# EAGLE design MAX5419 (EAGLE 8.2.2)
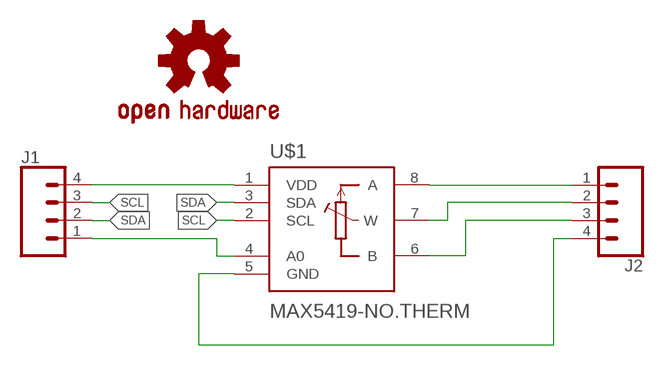
[diagram p0: schematic, sheet 1]

## Parts
J1  CONN_041X04_NO_SILK  [1X04_NO_SILK]
J2  CONN_041X04_NO_SILK  [1X04_NO_SILK]
LOGO1  OSHW-LOGOS  [OSHW-LOGO-S]
U$1  MAX5419-NO.THERM  [TDFN8-3X3MM]

## Nets
N$1: J2.1 U$1.8(A)
N$2: J2.2 U$1.7(W)
N$3: J2.3 U$1.6(B)
N$4: J2.4 U$1.5(GND)
N$5: J1.4 U$1.1(VDD)
N$8: J1.1 U$1.4(A0)
SCL: J1.3 U$1.2(SCL)
SDA: J1.2 U$1.3(SDA)

## Library data of the parts
J1 J2 = CalvEngIO-Connectors:CONN_04: Multi connection point. Often used as Generic Header-pin footprint for 0.1 inch spaced/style header connections On any of the 0.1 inch spaced packages, you can populate with these: Break Away Headers - Straight <https://www.sparkfun.com/products/116> (PRT-00116) Break Away Male Headers - Right Angle <https://www.sparkfun.com/products/553> (PRT-00553) Female Headers <https://www.sparkfun.com/products/115> (PRT-00115) Break Away Headers - Machine Pin <https://www.sparkfun.com/products/117> (PRT-00117) Break Away Female Headers - Swiss Machine Pin <https://www.sparkfun.com/products/743> (PRT-00743) For SCREWTERMINALS and SPRING TERMINALS visit here: Screw Terimnals on SparkFun.com <https://www.sparkfun.com/search/results?term=Screw+Terminals> (5mm/3.5mm/2.54mm spacing) This device is also useful as a general connection point to wire up your design to another part of your project. Our various solder wires solder well into these plated through hole pads. Hook-Up Wire - Assortment (Stranded, 22 AWG) <https://www.sparkfun.com/products/11375> (PRT-11375) Hook-Up Wire - Assortment (Solid Core, 22 AWG) <https://www.sparkfun.com/products/11367> (PRT-11367) View the entire wire category on our website here <https://www.sparkfun.com/categories/141> Special notes: Molex polarized connector foot print use with SKU : PRT-08231 with associated crimp pins and housings. 1MM SMD Version SKU: PRT-10208; PROD_ID: CONN-09696
LOGO1 = CalvEngIO-Logos:OSHW-LOGO: Open-Source Hardware (OSHW) Logo This logo indicates the piece of hardware it is found on incorporates a OSHW license and/or adheres to the definition of open source hardware found here: http://freedomdefined.org/OSHW
U$1 = CalvEngIO-DigitalIC:MAX5419

## Board
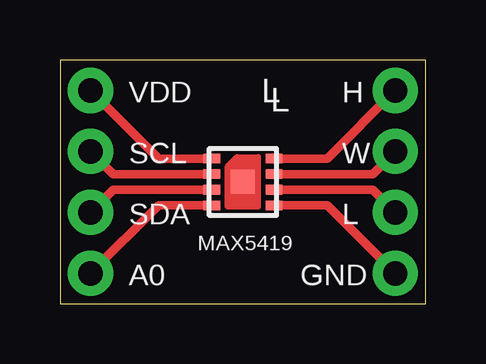
[diagram p1: board, top side]
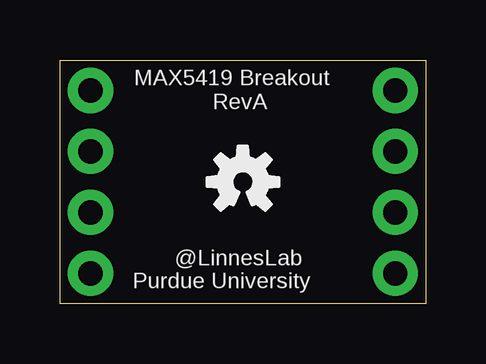
[diagram p2: board, bottom side, seen from below]

Size 15.24 x 10.16 mm. Coordinates in mm from the lower left corner, seen from the top.
Outline: 0,0 15.24,0 15.24,10.16 0,10.16 0,0
Copper layers (1*16): Top 0.035mm / dielectric 1.5mm / Bottom 0.035mm
Design rules "default": minimum track width 10mil, minimum drill 24mil, track to track 8mil, track to pad 8mil, pad to pad 8mil, via to via 8mil, smd to smd 8mil, copper to edge 40mil, drill to drill 8mil, minimum pad ring 10mil, minimum via ring 8mil, stop-mask expansion 4mil, vias tented up to drill 0mil, thermal gap 10mil

### Footprints (pad centres in the part's own frame; a part is rotated, then mirrored left to right if it is on the bottom)
1X04_NO_SILK = drill 1.016 pad 1.88: 1 0,0; 2 2.54,0; 3 5.08,0; 4 7.62,0
TDFN8-3X3MM = smd 0.7 x 0.4: 1 -1.3,0.975; 2 -1.3,0.325; 3 -1.3,-0.325; 4 -1.3,-0.975; 5 1.3,-0.975; 6 1.3,-0.325; 7 1.3,0.325; 8 1.3,0.975 | smd 1 x 1: TH 0,0

### Placement (x,y rotation side)
J1  1.27,1.27 90 top
J2  13.97,8.89 270 top
LOGO1  7.62,5.08 0 bottom
U$1  7.62,5.08 0 top

### Tracks (layer width: path | path; a pad name or v marks a point on that pad's centre or on a via)
N$1
  Top 0.356: U$1.8 11.13,6.05 J2.1
N$2
  Top 0.356: U$1.7 13.03,5.41 J2.2
N$3
  Top 0.356: U$1.6 13.03,4.75 J2.3
N$4
  Top 0.356: U$1.5 11.13,4.11 J2.4
N$5
  Top 0.356: U$1.1 4.11,6.05 J1.4
N$8
  Top 0.356: U$1.4 4.11,4.11 J1.1
SCL
  Top 0.356: U$1.2 2.21,5.41 J1.3
SDA
  Top 0.356: U$1.3 2.21,4.75 J1.2

### Text on the board
tPlace: VDD | H | SCL | W | SDA | L | MAX5419 | A0 | GND
bPlace: RevA | @LinnesLab | Purdue University
tNames: L | L
bNames: MAX5419 Breakout